# EAGLE schematic prototype_WLCSP (EAGLE 7.7.0)
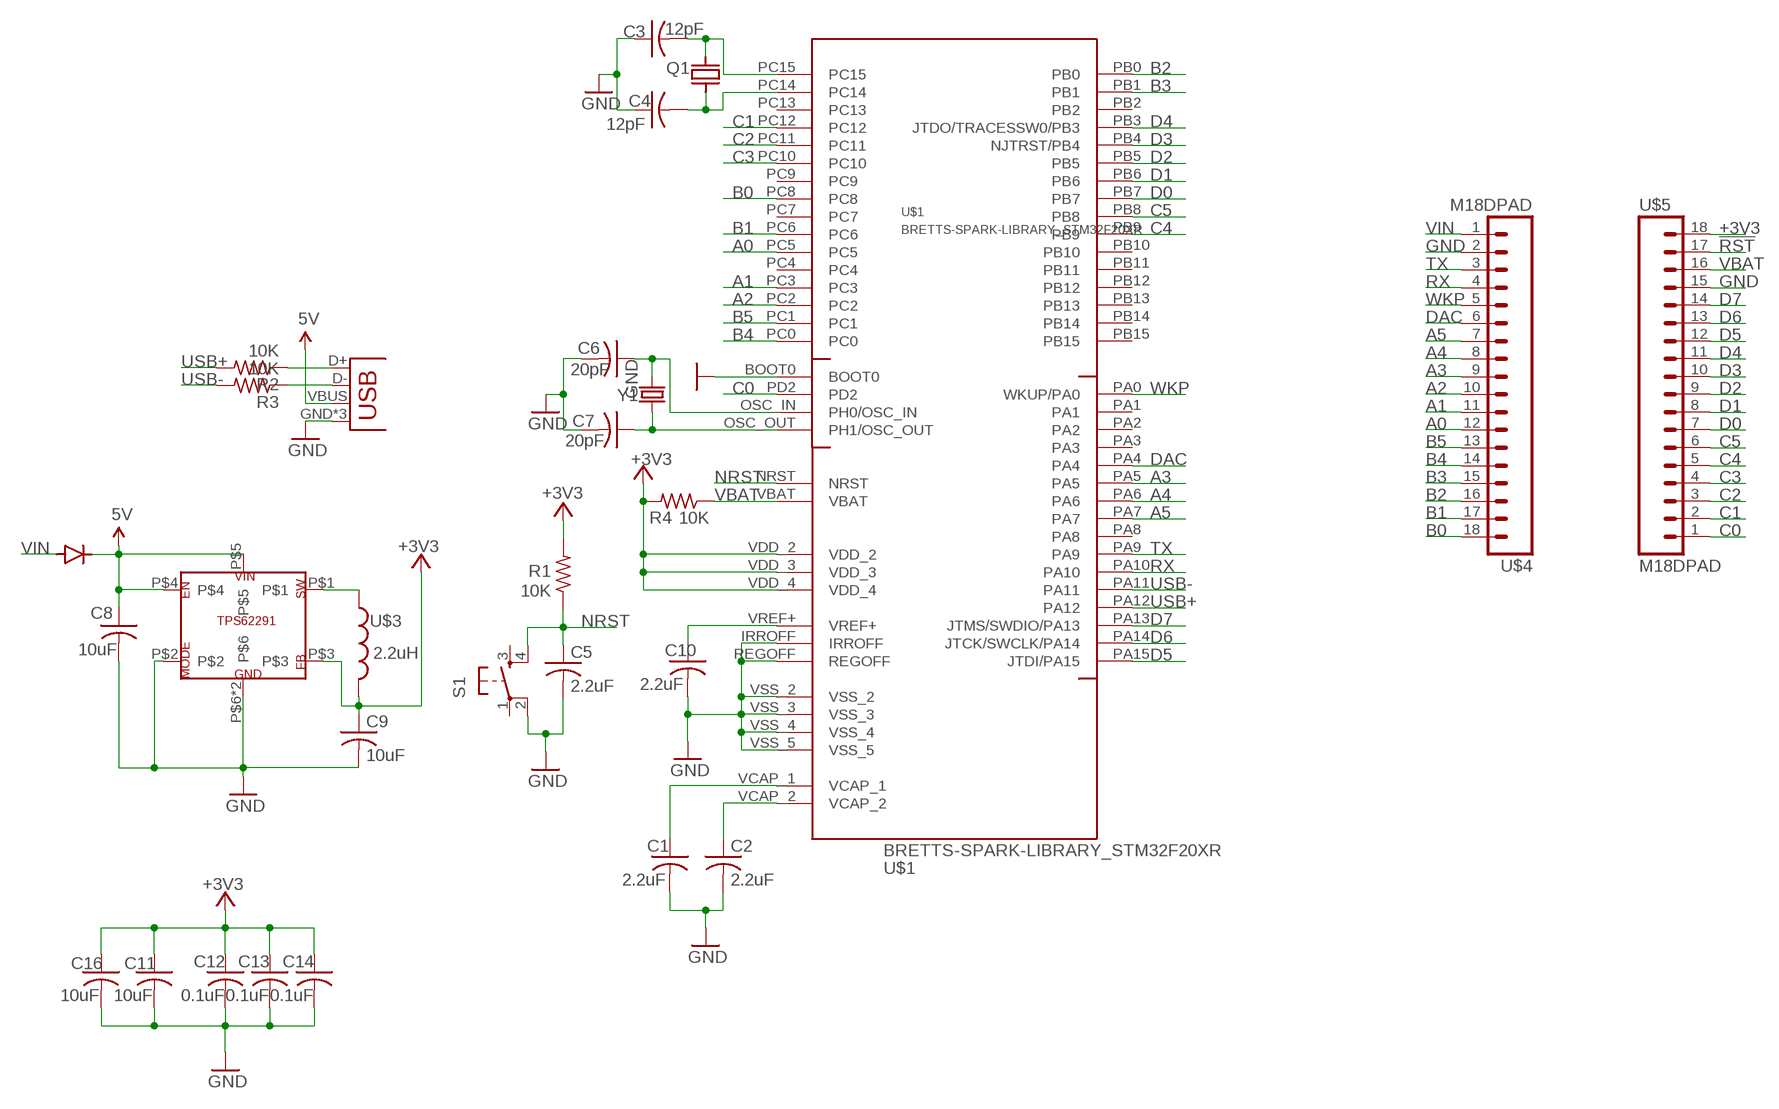
[diagram p0: schematic, sheet 1]

## Parts
C1  2.2uF  SPARK_C-US  [SPARK_C0402_B]
C2  2.2uF  SPARK_C-US  [SPARK_C0402_B]
C3  12pF  SPARK_C-US  [SPARK_C0402_B]
C4  12pF  SPARK_C-US  [SPARK_C0402_B]
C5  2.2uF  SPARK_C-US  [SPARK_C0402_B]
C6  20pF  SPARK_C-US  [SPARK_C0402_B]
C7  20pF  SPARK_C-US  [SPARK_C0402_B]
C8  10uF  BRETTS-SPARK-LIBRARY_C-US0603  [BRETTS-SPARK-LIBRARY_C0603_B]
C9  10uF  BRETTS-SPARK-LIBRARY_C-US0603  [BRETTS-SPARK-LIBRARY_C0603_B]
C10  2.2uF  SPARK_C-US  [SPARK_C0402_B]
C11  10uF  BRETTS-SPARK-LIBRARY_C-US0603  [BRETTS-SPARK-LIBRARY_C0603_B]
C12  0.1uF  SPARK_C-US  [SPARK_C0402_B]
C13  0.1uF  SPARK_C-US  [SPARK_C0402_B]
C14  0.1uF  SPARK_C-US  [SPARK_C0402_B]
C16  10uF  BRETTS-SPARK-LIBRARY_C-US0603  [BRETTS-SPARK-LIBRARY_C0603_B]
JP1  SPARK_USB-MICROB  [SPARK_USB-MICROB]
Q1  SPARK_Q_FC135  [SPARK_FC135]
R1  10K  SPARK_R-US_  [SPARK_R0402_B]
R2  10K  SPARK_R-US_  [SPARK_R0402_B]
R3  10K  SPARK_R-US_  [SPARK_R0402_B]
R4  10K  SPARK_R-US_  [SPARK_R0402_B]
S1  SPARK_TAC_SWITCHSMD  [SPARK_TACTILE_SWITCH_SMD]
U$1  BRETTS-SPARK-LIBRARY_STM32F20XR  [STM32F205_WLCSP]
U$2  PARTICLE_TPS62291DRV  [PARTICLE_S-PWSON-N6]
U$3  2.2uH  PARTICLE_INDUCTORB  [PARTICLE_INDUCTOR-NR3015]
U$4  M18DPAD  PARTICLE_M18DPAD  [PARTICLE_1X18-D-PADS]
U$5  M18DPAD  PARTICLE_M18DPAD  [PARTICLE_1X18-D-PADS]
U$6  PARTICLE_DIODE_NT  [PARTICLE_DIODE-DO-220AA_NT(SMP)]
Y1  SPARKFUN-FREQCTRL_CRYSTAL5X3  [SPARKFUN-FREQCTRL_CRYSTAL-SMD-5X3]

## Nets
5V: C8.1 JP1.VBUS U$2.P$4 U$2.P$5 U$6.CATHODE
!RST: U$5.17
+3V3: C9.1 C11.1 C12.1 C13.1 C14.1 C16.1 R1.2 R4.2 U$1.VDD_2 U$1.VDD_3 U$1.VDD_4 U$2.P$3 U$3.2 U$5.18
A0: U$1.PC5 U$4.12
A1: U$1.PC3 U$4.11
A2: U$1.PC2 U$4.10
A3: U$1.PA5 U$4.9
A4: U$1.PA6 U$4.8
A5: U$1.PA7 U$4.7
B0: U$1.PC8 U$4.18
B1: U$1.PC6 U$4.17
B2: U$1.PB0 U$4.16
B3: U$1.PB1 U$4.15
B4: U$1.PC0 U$4.14
B5: U$1.PC1 U$4.13
C0: U$1.PD2 U$5.1
C1: U$1.PC12 U$5.2
C2: U$1.PC11 U$5.3
C3: U$1.PC10 U$5.4
C4: U$1.PB9 U$5.5
C5: U$1.PB8 U$5.6
D0: U$1.PB7 U$5.7
D1: U$1.PB6 U$5.8
D2: U$1.PB5 U$5.9
D3: U$1.PB4(NJTRST/PB4) U$5.10
D4: U$1.PB3(JTDO/TRACESSW0/PB3) U$5.11
D5: U$1.PA15(JTDI/PA15) U$5.12
D6: U$1.PA14(JTCK/SWCLK/PA14) U$5.13
D7: U$1.PA13(JTMS/SWDIO/PA13) U$5.14
DAC: U$1.PA4 U$4.6
GND: C1.2 C2.2 C3.1 C4.1 C5.2 C6.2 C7.2 C8.2 C9.2 C10.2 C11.2 C12.2 C13.2 C14.2 C16.2 JP1.GND JP1.MT1(GND) JP1.MT2(GND) S1.2 U$1.BOOT0 U$1.IRROFF U$1.REGOFF U$1.VSS_2 U$1.VSS_3 U$1.VSS_4 U$1.VSS_5 U$2.P$2 U$2.P$6 U$2.TP U$4.2 U$5.15
N$1: JP1.D+ R2.1
N$2: JP1.D- R3.1
N$3: C3.2 Q1.X2 U$1.PC15
N$4: C4.2 Q1.X1 U$1.PC14
N$5: C2.1 U$1.VCAP_2
N$6: C1.1 U$1.VCAP_1
N$7: C7.1 U$1.OSC_OUT(PH1/OSC_OUT) Y1.1
N$9: C6.1 U$1.OSC_IN(PH0/OSC_IN) Y1.3
N$11: C10.1 U$1.VREF+
N$12: U$2.P$1 U$3.1
NRST: C5.1 R1.1 S1.4 U$1.NRST
RX: U$1.PA10 U$4.4
TX: U$1.PA9 U$4.3
USB+: R2.2 U$1.PA12
USB-: R3.2 U$1.PA11
VBAT: R4.1 U$1.VBAT U$5.16
VIN: U$4.1 U$6.ANODE
WKP: U$1.PA0(WKUP/PA0) U$4.5
Unconnected: S1.1 S1.3 U$1.PA1 U$1.PA2 U$1.PA3 U$1.PA8 U$1.PB2 U$1.PB10 U$1.PB11 U$1.PB12 U$1.PB13 U$1.PB14 U$1.PB15 U$1.PC4 U$1.PC7 U$1.PC9 U$1.PC13

## Library data of the parts
C1-C7 C10 C12-C14 = electron_v020:SPARK_C-US: Capacitor
C8 C9 C11 C16 = electron_v020:BRETTS-SPARK-LIBRARY_C-US: Capacitor
JP1 = electron_v020:SPARK_USB; PROD_ID: CONN-09505
Q1 = electron_v020:SPARK_Q
R1-R4 = electron_v020:SPARK_R-US_: 0402 Resistor
S1 = electron_v020:SPARK_TAC_SWITCH: SMD Tactiile Switch
U$1 = electron_v020:BRETTS-SPARK-LIBRARY_STM32F20XR
U$2 = electron_v020:PARTICLE_TPS62291
U$3 = electron_v020:PARTICLE_INDUCTOR
U$4 U$5 = electron_v020:PARTICLE_M18
U$6 = electron_v020:PARTICLE_DIODE
Y1 = electron_v020:SPARKFUN-FREQCTRL_CRYSTAL: Various standard crystals. Proven footprints. Spark Fun Electronics SKU : COM-00534